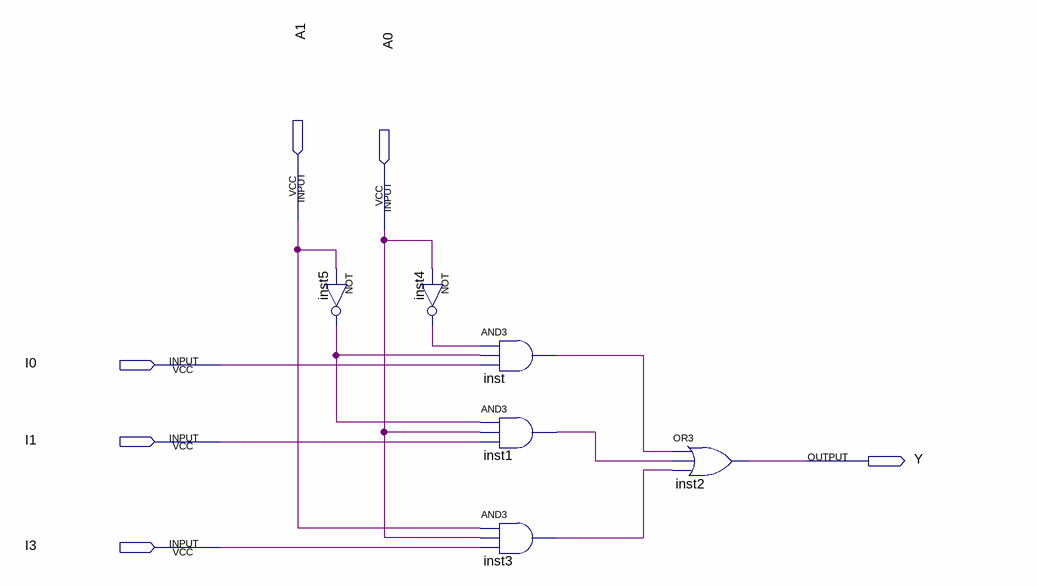
[diagram p0: schematic sheet]
// Quartus schematic MULTI41.bdf as structural Verilog: 6 symbols, 6 pins
module MULTI41 (
  input  A1,
  input  A0,
  input  I0,
  input  I1,
  input  I3,
  output Y
);

  wire inst1_out, inst3_out, inst4_out, inst5_out, inst_out;

  not inst5 (inst5_out, A1);
  not inst4 (inst4_out, A0);
  and inst (inst_out, inst4_out, inst5_out, I0);
  and inst1 (inst1_out, inst5_out, A0, I1);
  and inst3 (inst3_out, A1, A0, I3);
  or inst2 (Y, inst_out, inst1_out, inst3_out);
endmodule
